# Altium schematic sheet Amplifier.SchDoc
size 420 x 297 mm; SheetNumber: 2; SheetTotal: 4
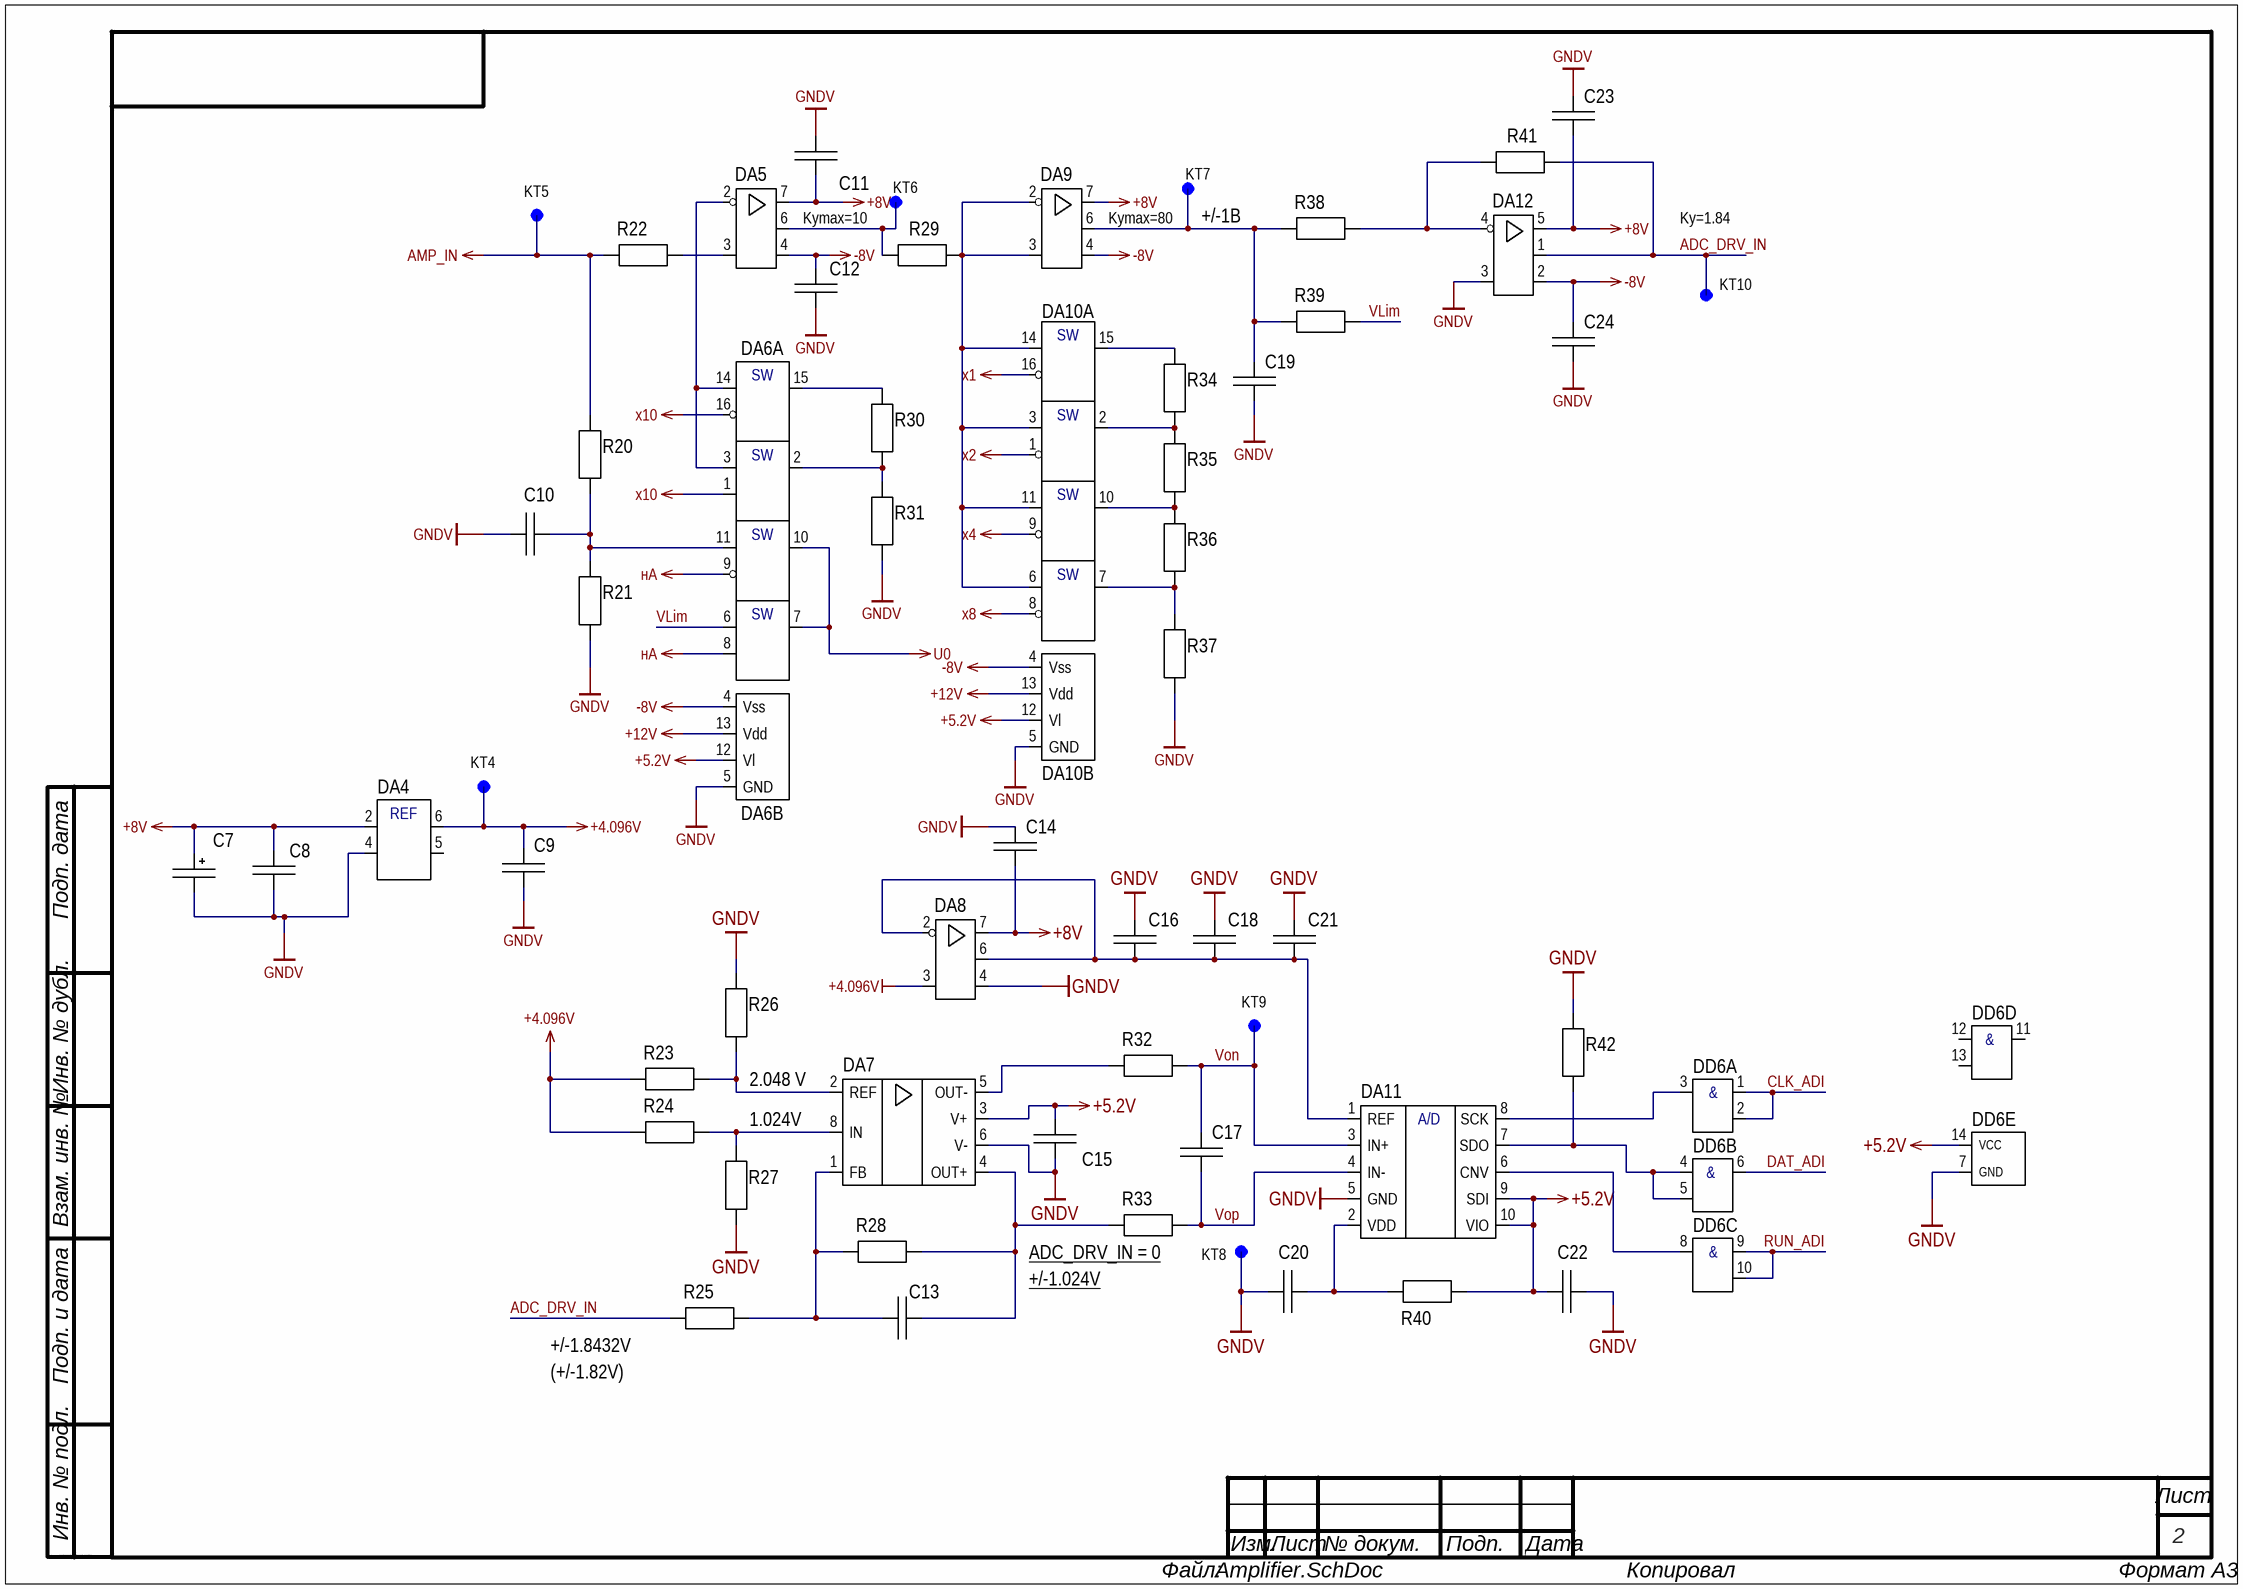
[diagram p0: Amplifier.SchDoc]

## Parts
C7  JRB-50В-4,7мкФ  [CAP TH ALUM ELEC D5.00mm S2.00mm H11.00mm]  (value not drawn)
C8  1206-X7R-50 B-0,1 мкФ+-10%  [CAP: 1206]  (value not drawn)
C9  0805-X7R-25 В-0,1 мкФ +-10%  [CAP: 0805]  (value not drawn)
C10  1206-X7R-50 B-0,01 мкФ+-10%  [CAP: 1206]  (value not drawn)
C11  1206-X7R-50 B-0,1 мкФ+-10%  [CAP: 1206]  (value not drawn)
C12  1206-X7R-50 B-0,1 мкФ+-10%  [CAP: 1206]  (value not drawn)
C13  0805-C0G-50 В-240 пФ +-5%  [CAP: 0805]  (value not drawn)
C14  1206-X7R-50 B-0,1 мкФ+-10%  [CAP: 1206]  (value not drawn)
C15  1206-X7R-50 B-0,1 мкФ+-10%  [CAP: 1206]  (value not drawn)
C16  1206-X7R-10 B-10 мкФ+-10%  [CAP: 1206]  (value not drawn)
C17  1206-X7R-50 B-0,01 мкФ+-10%  [CAP: 1206]  (value not drawn)
C18  1206-X7R-50 B-2,2 мкФ+-10%  [CAP: 1206]  (value not drawn)
C19  1206-X7R-50 B-0,01 мкФ+-10%  [CAP: 1206]  (value not drawn)
C20  1206-X7R-50 B-2,2 мкФ+-10%  [CAP: 1206]  (value not drawn)
C21  1206-X7R-50 B-2,2 мкФ+-10%  [CAP: 1206]  (value not drawn)
C22  1206-X7R-50 B-0,33 мкФ+-10%  [CAP: 1206]  (value not drawn)
C23  1206-X7R-50 B-0,1 мкФ+-10%  [CAP: 1206]  (value not drawn)
C24  1206-X7R-50 B-0,1 мкФ+-10%  [CAP: 1206]  (value not drawn)
DA4  ADR434BR  [8-SOIC]  (value not drawn)
DA5  ADA4637-1ARZ  [8-SOIC]  (value not drawn)
DA6  ADG433BR  [16-SOIC]  (value not drawn)  (parts A,B of 5)
DA7  ADA4941-1YRZ  [8-SOIC]  (value not drawn)
DA8  AD8031BRZ  [8-SOIC]  (value not drawn)
DA9  ADA4637-1ARZ  [8-SOIC]  (value not drawn)
DA10  ADG431BR  [16-SOIC]  (value not drawn)  (parts A,B of 5)
DA11  AD7691BRM  [10-MSOP]  (value not drawn)
DA12  TLV9151IDR  [SOT-23-5]  (value not drawn)
DD6  IN74HC08AD  [14-SOIC]  (value not drawn)  (parts A,B,C,D,E of 5)
KT4  OTV10  [OTV10]  (value not drawn)  (no BOM)
KT5  OTV10  [OTV10]  (value not drawn)  (no BOM)
KT6  OTV10  [OTV10]  (value not drawn)  (no BOM)
KT7  OTV10  [OTV10]  (value not drawn)  (no BOM)
KT8  OTV10  [OTV10]  (value not drawn)  (no BOM)
KT9  OTV10  [OTV10]  (value not drawn)  (no BOM)
KT10  OTV10  [OTV10]  (value not drawn)  (no BOM)
R20  1206-5,1 кОм+-5%  [1206]  (value not drawn)
R21  1206-20 кОм+-5%  [1206]  (value not drawn)
R22  1206-470 Ом+-5%  [1206]  (value not drawn)
R23  0805-1 кОм+-0,1%  [0805]  (value not drawn)
R24  0805-1 кОм+-0,1%  [0805]  (value not drawn)
R25  0805-1 кОм+-0,1%  [0805]  (value not drawn)
R26  0805-1 кОм+-0,1%  [0805]  (value not drawn)
R27  0805-332 Ом+-0,1%  [0805]  (value not drawn)
R28  0805-1 кОм+-0,1%  [0805]  (value not drawn)
R29  1206-470 Ом+-5%  [1206]  (value not drawn)
R30  1206-9,09 кОм+-1%  [1206]  (value not drawn)
R31  1206-1 кОм+-1%  [1206]  (value not drawn)
R32  1206-51 Ом+-5%  [1206]  (value not drawn)
R33  1206-51 Ом+-5%  [1206]  (value not drawn)
R34  1206-4,02 кОм+-0,1%  [1206]  (value not drawn)
R35  1206-2 кОм+-0.1%  [1206]  (value not drawn)
R36  1206-1 кОм+-0.1%  [1206]  (value not drawn)
R37  1206-1 кОм+-0.1%  [1206]  (value not drawn)
R38  1206-1 кОм+-0.1%  [1206]  (value not drawn)
R39  1206-5,1 кОм+-5%  [1206]  (value not drawn)
R40  1206-10 Ом+-5%  [1206]  (value not drawn)
R41  1206-1,82 кОм+-0,1%  [1206]  (value not drawn)
R42  1206-10 кОм+-5%  [1206]  (value not drawn)

## Nets
+4.096V: C9.2 DA4.6(Vout) DA8.3(+IN) KT4.1 R23.1 R24.1
+5.2V: C15.1 C22.1 DA6.12(Vl) DA7.3(V+) DA10.12(Vl) DA11.9(SDI) DA11.10(VIO) DD6.14(VCC) R40.2
+8V: C7.1 C8.2 C11.2 C14.1 C23.1 DA4.2(+Vin) DA5.7(Vs+) DA8.7(Vs+) DA9.7(Vs+) DA12.5(Vs+)
+12V: DA6.13(Vdd) DA10.13(Vdd)
-8V: C12.1 C24.2 DA5.4(Vs-) DA6.4(Vss) DA9.4(Vs-) DA10.4(Vss) DA12.2(Vs-)
AMP_IN: KT5.1 R20.2 R22.1
GNDV: C7.2 C8.1 C9.1 C10.2 C11.1 C12.2 C14.2 C15.2 C16.2 C18.2 C19.1 C20.1 C21.2 C22.2 C23.2 C24.1 DA4.4(GND) DA6.5(GND) DA7.6(V-) DA8.4(Vs-) DA10.5(GND) DA11.5(GND) DA12.3(+IN) DD6.7(GND) KT8.1 R21.1 R26.2 R27.1 R31.1 R37.1 R42.1
U0: DA6.7(D4) DA6.10(D3)
x1: DA10.16(IN2)
x2: DA10.1(IN1)
x4: DA10.9(IN3)
x8: DA10.8(IN4)
x10: DA6.1(IN1) DA6.16(IN2)
нА: DA6.8(IN4) DA6.9(IN3)
ADC_DRV_IN: DA12.1(OUT) KT10.1 R25.1 R41.2
CLK_ADI: DD6.1(A1) DD6.2(B1)
DAT_ADI: DD6.6(Y2)
RUN_ADI: DD6.9(A3) DD6.10(B3)
VLim: DA6.6(S4) R39.1
Von: C17.2 DA11.3(IN+) KT9.1 R32.2
Vop: C17.1 DA11.4(IN-) R33.2
NetC10_1: C10.1 DA6.11(S3) R20.1 R21.2
NetC13_1: C13.1 DA7.1(FB) R25.2 R28.1
NetC13_2: C13.2 DA7.4(OUT+) R28.2 R33.1
NetC16_1: C16.1 C18.1 C21.1 DA8.2(-IN) DA8.6(OUT) DA11.1(REF)
NetC19_2: C19.2 DA9.6(OUT) KT7.1 R38.1 R39.2
NetC20_2: C20.2 DA11.2(VDD) R40.1
NetDA5_2: DA5.2(-IN) DA6.3(S1) DA6.14(S2)
NetDA5_3: DA5.3(+IN) R22.2
NetDA5_6: DA5.6(OUT) KT6.1 R29.1
NetDA6_2: DA6.2(D1) R30.1 R31.2
NetDA6_15: DA6.15(D2) R30.2
NetDA7_2: DA7.2(REF) R23.2 R26.1
NetDA7_5: DA7.5(OUT-) R32.1
NetDA7_8: DA7.8(IN) R24.2 R27.2
NetDA9_2: DA9.2(-IN) DA9.3(+IN) DA10.3(S1) DA10.6(S4) DA10.11(S3) DA10.14(S2) R29.2
NetDA10_2: DA10.2(D1) R34.1 R35.2
NetDA10_7: DA10.7(D4) R36.1 R37.2
NetDA10_10: DA10.10(D3) R35.1 R36.2
NetDA10_15: DA10.15(D2) R34.2
NetDA11_6: DA11.6(CNV) DD6.8(Y3)
NetDA11_7: DA11.7(SDO) DD6.4(A2) DD6.5(B2) R42.2
NetDA11_8: DA11.8(SCK) DD6.3(Y1)
NetDA12_4: DA12.4(-IN) R38.2 R41.1

Not connected (* = marked no-connect by the designer): DA4 5(TRIM); DD6 11(Y4) 12(A4) 13(B4)

## Notes on the sheet
- Kymax=10
- Kymax=80
- (near KT7) +/-1В
- Ky=1.84
- 2.048 V
- 1.024V
- (near R33) ADC_DRV_IN = 0
- (near R33) +/-1.024V
- (near R25) +/-1.8432V
- (near R25) (+/-1.82V)
- Подп. дата
- Инв. № дубл.
- Взам. инв. №
- Подп. и дата
- Инв. № подл.
- Изм.
- Лист
- № докум.
- Подп.
- Дата
- ALTIUM GOSTBOM2.0 KEV
- Файл:
- Копировал
- Формат А3
- (in symbol AD7691BRM) A/D
- (in symbol ADG431BR, part A) SW
- (in symbol ADG433BR, part A) SW
- (in symbol ADR434BR) REF
- (in symbol IN74HC08AD, part A) &
- (in symbol IN74HC08AD, part B) &
- (in symbol IN74HC08AD, part C) &
- (in symbol IN74HC08AD, part D) &

## Library data of the parts
C8 C11 C12 C14 C15 C23 C24 = 1206-X7R-50 B-0,1 мкФ+-10%: Value: 0,1 мкФ
C9 = 0805-X7R-25 В-0,1 мкФ +-10%: Value: 0,1 мкФ
C13 = 0805-C0G-50 В-240 пФ +-5%: Value: 10 пФ
C16 = 1206-X7R-10 B-10 мкФ+-10%: Value: 10 мкФ
C18 C20 C21 = 1206-X7R-50 B-2,2 мкФ+-10%: Value: 2,2 мкФ
DA5 DA9 = ADA4637-1ARZ: 30 V, High Speed, Low Noise, Low Bias / Current, JFET Operational Amplifier
DA6 = ADG433BR: LC2MOS Precision Quad SPST Switches; Value: *
DA7 = ADA4941-1YRZ: Single-Supply, Differential, 18-Bit ADC Driver
DA8 = AD8031BRZ: Rail-to-Rail I/O Amplifiers 2.7 V, 800 μA, 80 MHz
DA10 = ADG431BR: LC2MOS Precision Quad SPST Switches; Value: *
DD6 = IN74HC08AD: Quad 2-Input AND Gate High-Performance Silicon-Gate CMOS
R20 R39 = 1206-5,1 кОм+-5%: Value: 5,1 кОм; ModelPrint: 1206
R21 = 1206-20 кОм+-5%: Value: 20 кОм; ModelPrint: 1206
R22 R29 = 1206-470 Ом+-5%: Value: 470 Ом; ModelPrint: 1206
R23-R26 R28 = 0805-1 кОм+-0,1%: Value: 1 кОм; ModelPrint: 0805
R27 = 0805-332 Ом+-0,1%: Value: 332 Ом; ModelPrint: 0805
R31 = 1206-1 кОм+-1%: Value: 1 кОм; ModelPrint: 1206
R32 R33 = 1206-51 Ом+-5%: Value: 51 Ом; ModelPrint: 1206
R35 = 1206-2 кОм+-0.1%: Value: 2 кОм; ModelPrint: 1206
R36-R38 = 1206-1 кОм+-0.1%: Value: 1 кОм; ModelPrint: 1206
R40 = 1206-10 Ом+-5%: Value: 10 Ом; ModelPrint: 1206
R42 = 1206-10 кОм+-5%: Value: 10 кОм; ModelPrint: 1206
C10 C17 C19 = 1206-X7R-50 B-0,01 мкФ+-10%: Value: 0,01 мкФ
C22 = 1206-X7R-50 B-0,33 мкФ+-10%: Value: 0,33 мкФ
R30 = 1206-9,09 кОм+-1%: ModelPrint: 1206; Value: 9,09 кОм
R34 = 1206-4,02 кОм+-0,1%: ModelPrint: 1206; Value: 4,02 кОм
R41 = 1206-1,82 кОм+-0,1%: ModelPrint: 1206; Value: 1,82 кОм